# EAGLE design audibleCore (EAGLE 6.5.0)
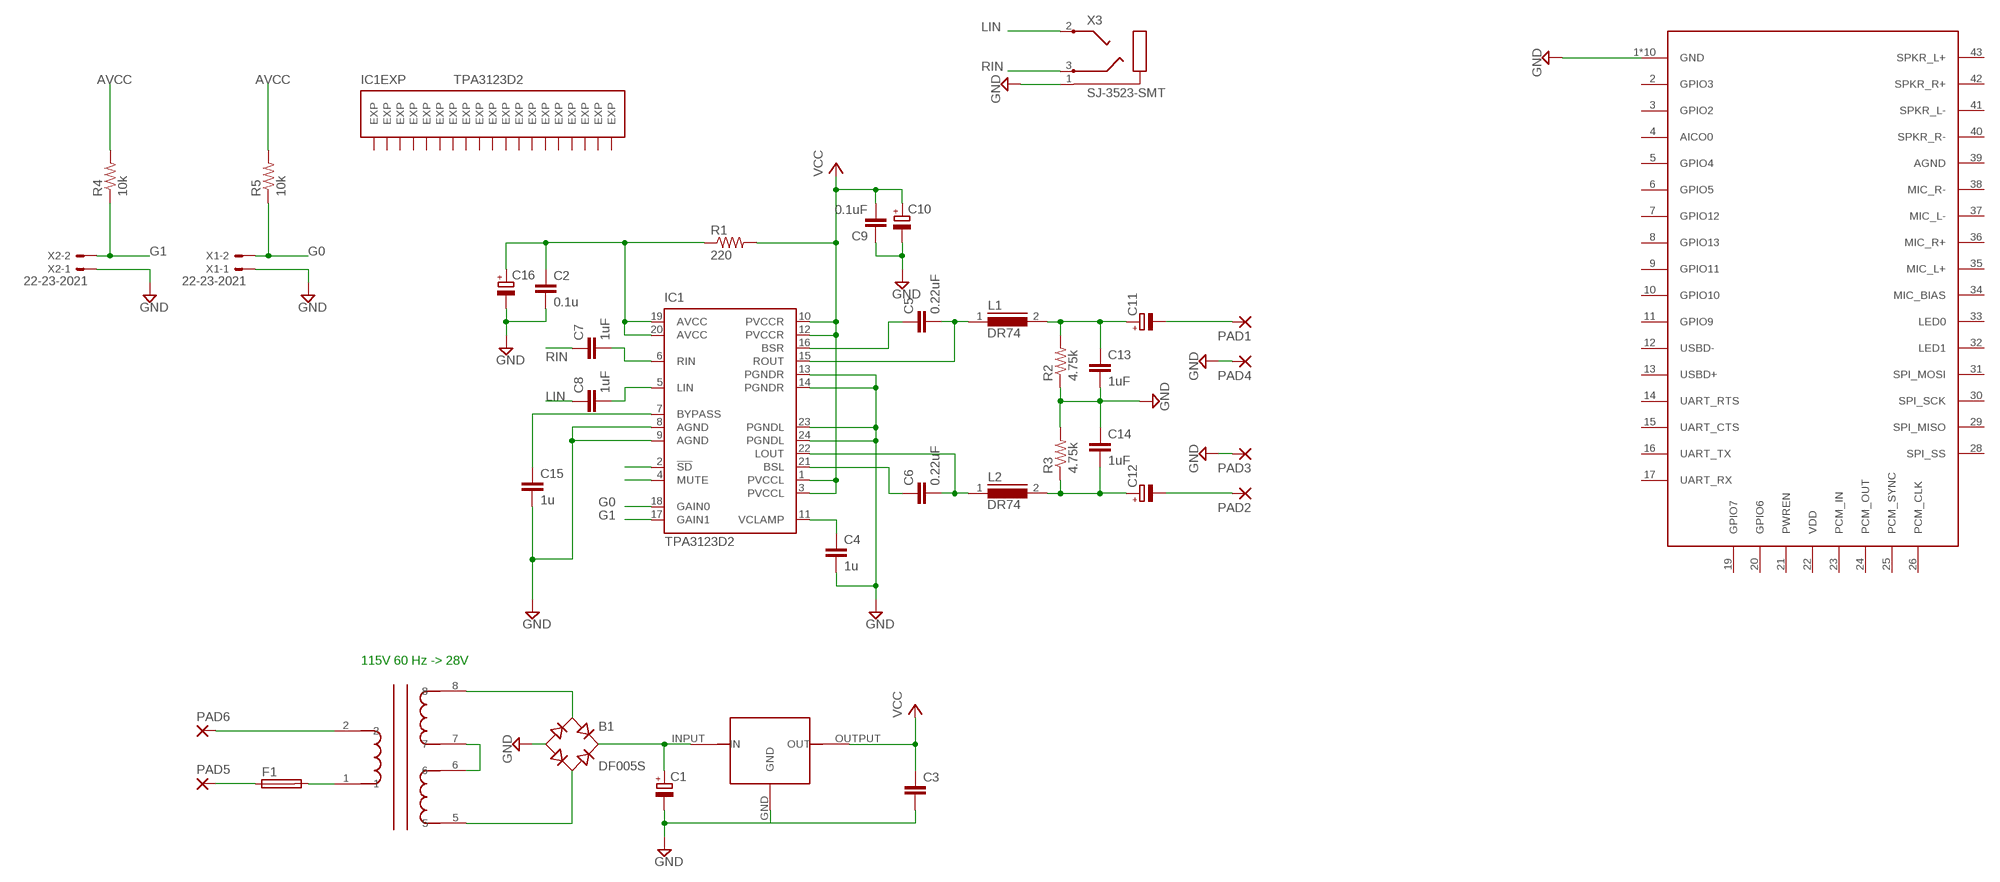
[diagram p0: schematic, sheet 1]

## Parts
B1  DF005S  [DFS]
C1  CPOL-EUG  [PANASONIC_G]
C2  0.1u  C-EUC1206  [C1206]
C3  C-EUC1206  [C1206]
C4  1u  C-EUC1206  [C1206]
C5  0.22uF  C-EUC1206  [C1206]
C6  0.22uF  C-EUC1206  [C1206]
C7  1uF  C-EUC1206  [C1206]
C8  1uF  C-EUC1206  [C1206]
C9  0.1uF  C-EUC1206  [C1206]
C10  CPOL-EUG  [PANASONIC_G]
C11  CPOL-EUG  [PANASONIC_G]
C12  CPOL-EUG  [PANASONIC_G]
C13  1uF  C-EUC1206  [C1206]
C14  1uF  C-EUC1206  [C1206]
C15  1u  C-EUC1206  [C1206]
C16  CPOL-EUG  [PANASONIC_G]
F1  GSH15  [GSH15]
IC1  TPA3123D2  [PWP-TSSOP24]
L1  DR74  [DR74]
L2  DR74  [DR74]
PAD1  SMD5  [SMD2,54-5,08]
PAD2  SMD5  [SMD2,54-5,08]
PAD3  SMD5  [SMD2,54-5,08]
PAD4  SMD5  [SMD2,54-5,08]
PAD5  SMD5  [SMD2,54-5,08]
PAD6  SMD5  [SMD2,54-5,08]
R1  220  R-US_R1206  [R1206]
R2  4.75k  R-US_R1206  [R1206]
R3  4.75k  R-US_R1206  [R1206]
R4  10k  R-US_R1206  [R1206]
R5  10k  R-US_R1206  [R1206]
U$1  ST-7-24  [ST-7]
U$2  L78XX  [D2PAK]
U$3  RN-52  [RN-52]
X1  22-23-2021  [22-23-2021]
X2  22-23-2021  [22-23-2021]
X3  SJ-3523-SMT  [SJ-3523-SMT]

## Nets
AVCC: C2.1 C16.+ IC1.19(AVCC) IC1.20(AVCC) R1.1 R4.2 R5.2
G0: IC1.18(GAIN0) R5.1 X1.2
G1: IC1.17(GAIN1) R4.1 X2.2
GND: B1.- C1.- C2.2 C3.2 C4.2 C9.1 C10.- C13.2 C14.1 C15.2 C16.- IC1.8(AGND) IC1.9(AGND) IC1.13(PGNDR) IC1.14(PGNDR) IC1.23(PGNDL) IC1.24(PGNDL) PAD3.1(P) PAD4.1(P) R2.1 R3.2 U$2.GND U$3.1(GND) U$3.18(GND) U$3.27(GND) U$3.44(GND) U$3.45(GND) U$3.46(GND) U$3.47(GND) U$3.48(GND) U$3.49(GND) U$3.50(GND) X1.1 X2.1 X3.1(EARTH)
LIN: C8.1 X3.2(TIP)
N$1: U$1.6 U$1.7
N$2: B1.AC1 U$1.8
N$3: B1.AC2 U$1.5
N$4: B1.+ C1.+ U$2.INPUT(IN)
N$5: C12.- PAD2.1(P)
N$6: C4.1 IC1.11(VCLAMP)
N$7: C5.1 IC1.16(BSR)
N$8: C6.1 IC1.21(BSL)
N$9: C6.2 IC1.22(LOUT) L2.1
N$10: C5.2 IC1.15(ROUT) L1.1
N$11: C15.1 IC1.7(BYPASS)
N$12: C7.2 IC1.6(RIN)
N$13: C8.2 IC1.5(LIN)
N$14: C11.+ C13.1 L1.2 R2.2
N$16: C12.+ C14.2 L2.2 R3.1
N$17: C11.- PAD1.1(P)
N$18: IC1.2(!SD)
N$19: IC1.4(MUTE)
N$20: PAD6.1(P) U$1.2
N$21: F1.2 U$1.1
N$22: F1.1 PAD5.1(P)
RIN: C7.1 X3.3(RING)
VCC: C3.1 C9.2 C10.+ IC1.1(PVCCL) IC1.3(PVCCL) IC1.10(PVCCR) IC1.12(PVCCR) R1.2 U$2.OUTPUT(OUT)
Unconnected: IC1.EXP IC1.EXP@1(EXP) IC1.EXP@2(EXP) IC1.EXP@3(EXP) IC1.EXP@4(EXP) IC1.EXP@5(EXP) IC1.EXP@6(EXP) IC1.EXP@7(EXP) IC1.EXP@8(EXP) IC1.EXP@9(EXP) IC1.EXP@10(EXP) IC1.EXP@11(EXP) IC1.EXP@12(EXP) IC1.EXP@13(EXP) IC1.EXP@14(EXP) IC1.EXP@15(EXP) IC1.EXP@16(EXP) IC1.EXP@17(EXP) IC1.EXP@18(EXP) U$3.2(GPIO3) U$3.3(GPIO2) U$3.4(AICO0) U$3.5(GPIO4) U$3.6(GPIO5) U$3.7(GPIO12) U$3.8(GPIO13) U$3.9(GPIO11) U$3.10(GPIO10) U$3.11(GPIO9) U$3.12(USBD-) U$3.13(USBD+) U$3.14(UART_RTS) U$3.15(UART_CTS) U$3.16(UART_TX) U$3.17(UART_RX) U$3.19(GPIO7) U$3.20(GPIO6) U$3.21(PWREN) U$3.22(VDD) U$3.23(PCM_IN) U$3.24(PCM_OUT) U$3.25(PCM_SYNC) U$3.26(PCM_CLK) U$3.28(SPI_SS) U$3.29(SPI_MISO) U$3.30(SPI_SCK) U$3.31(SPI_MOSI) U$3.32(LED1) U$3.33(LED0) U$3.34(MIC_BIAS) U$3.35(MIC_L+) U$3.36(MIC_R+) U$3.37(MIC_L-) U$3.38(MIC_R-) U$3.39(AGND) U$3.40(SPKR_R-) U$3.41(SPKR_L-) U$3.42(SPKR_R+) U$3.43(SPKR_L+)

## Notes on the sheet
- 115V 60 Hz -> 28V

## Library data of the parts
B1 = rectifier:DF*S: Surface Mount Glass Passivated Bridge Rectifiers Source: Source: Comchip Bridge Rectifiers DF005S-G thru DF10S-G.pdf
C1 C10-C12 C16 = rcl:CPOL-EU: POLARIZED CAPACITOR, European symbol
C2-C9 C13-C15 = rcl:C-EU: CAPACITOR, European symbol
F1 = fuse:GSH15: FUSE HOLDER grid 15mm, 19649 Wickmann; MPN: 64900001039; OC_FARNELL: 1271673; OC_NEWARK: 02P0318
IC1 = texas:TPA3123D2: 25-W STEREO CLASS-D AUDIO POWER AMPLIFIER Please INVOKE gate EXP, set DRC-Clearance | Same signals | SMD - SMD = 0 Source: http://focus.ti.com/lit/ds/symlink/tpa3123d2.pdf; MPN: TPA3123D2PWP; OC_FARNELL: 1632099; OC_NEWARK: 53M3994
L1 L2 = inductors:DR74: High Power Density, High Efficiency, Shielded Inductors Source: coiltronics_dr_series.pdf
PAD1-PAD6 = wirepad:SMD5: SMD PAD
R1-R5 = rcl:R-US_: RESISTOR, American symbol
U$1 = signal_transformer:ST-7-24
U$2 = st-microelectronics:L78XX
U$3 = misc:RN-52
X1 X2 = con-molex:22-23-2021: .100" (2.54mm) Center Header - 2 Pin; MF: MOLEX; MPN: 22-23-2021; OC_FARNELL: 1462926; OC_NEWARK: 25C3832
X3 = con-cuistack:SJ-3523: 3.5 Stereo audio jack (SMT)

## Board
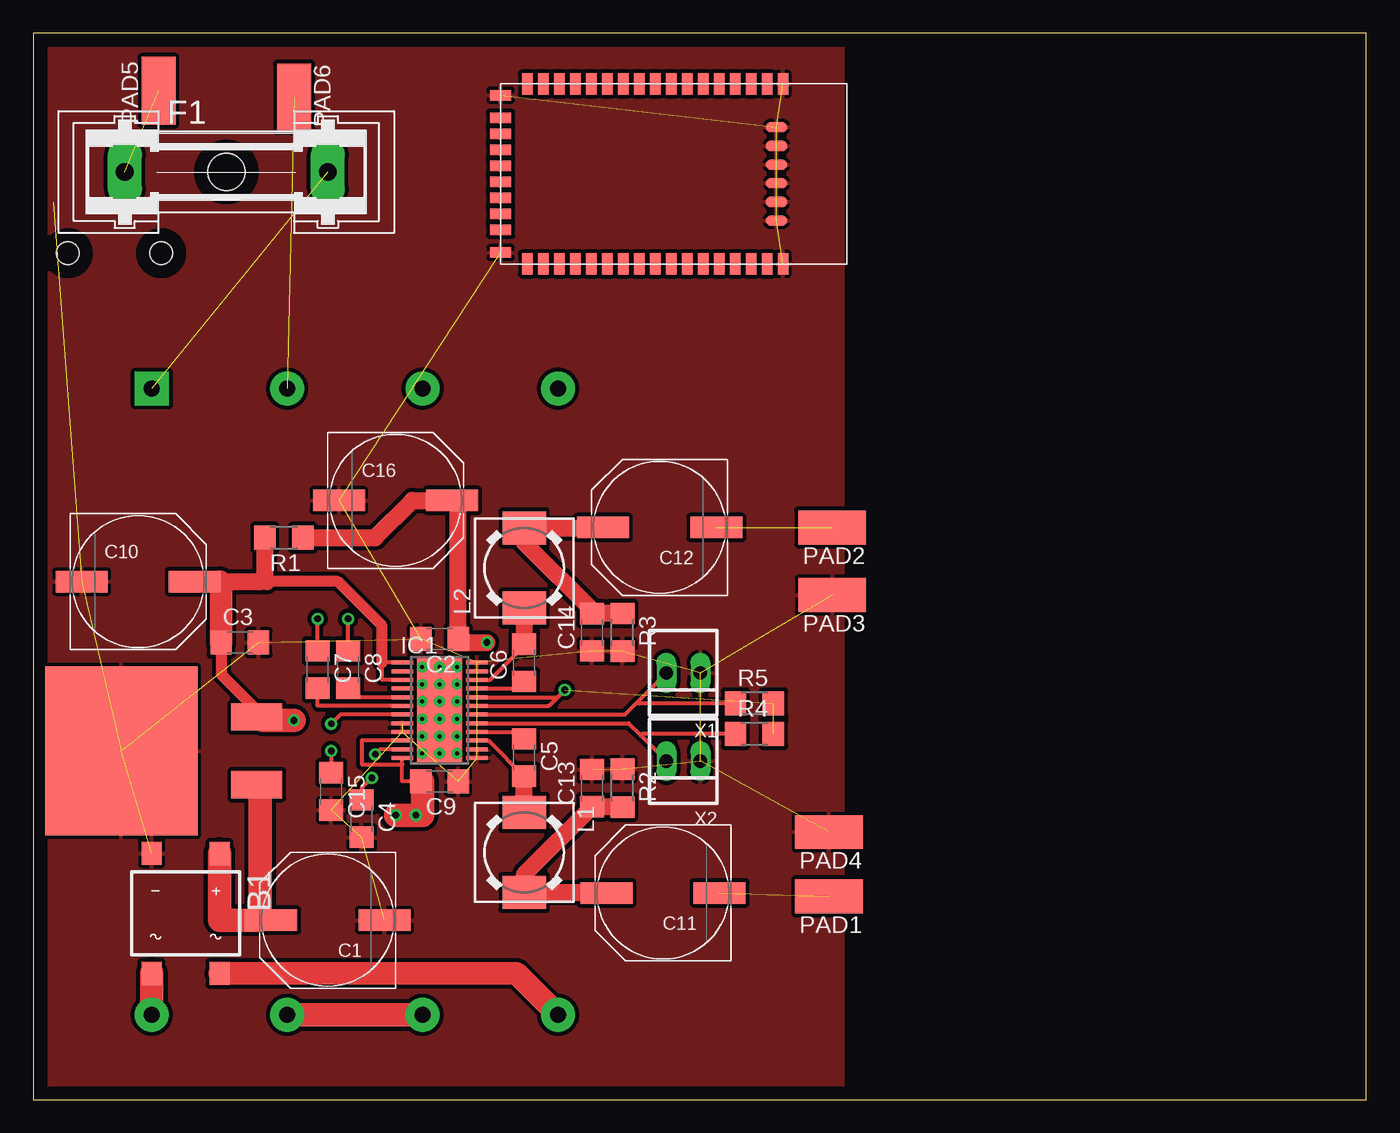
[diagram p1: board, top side]
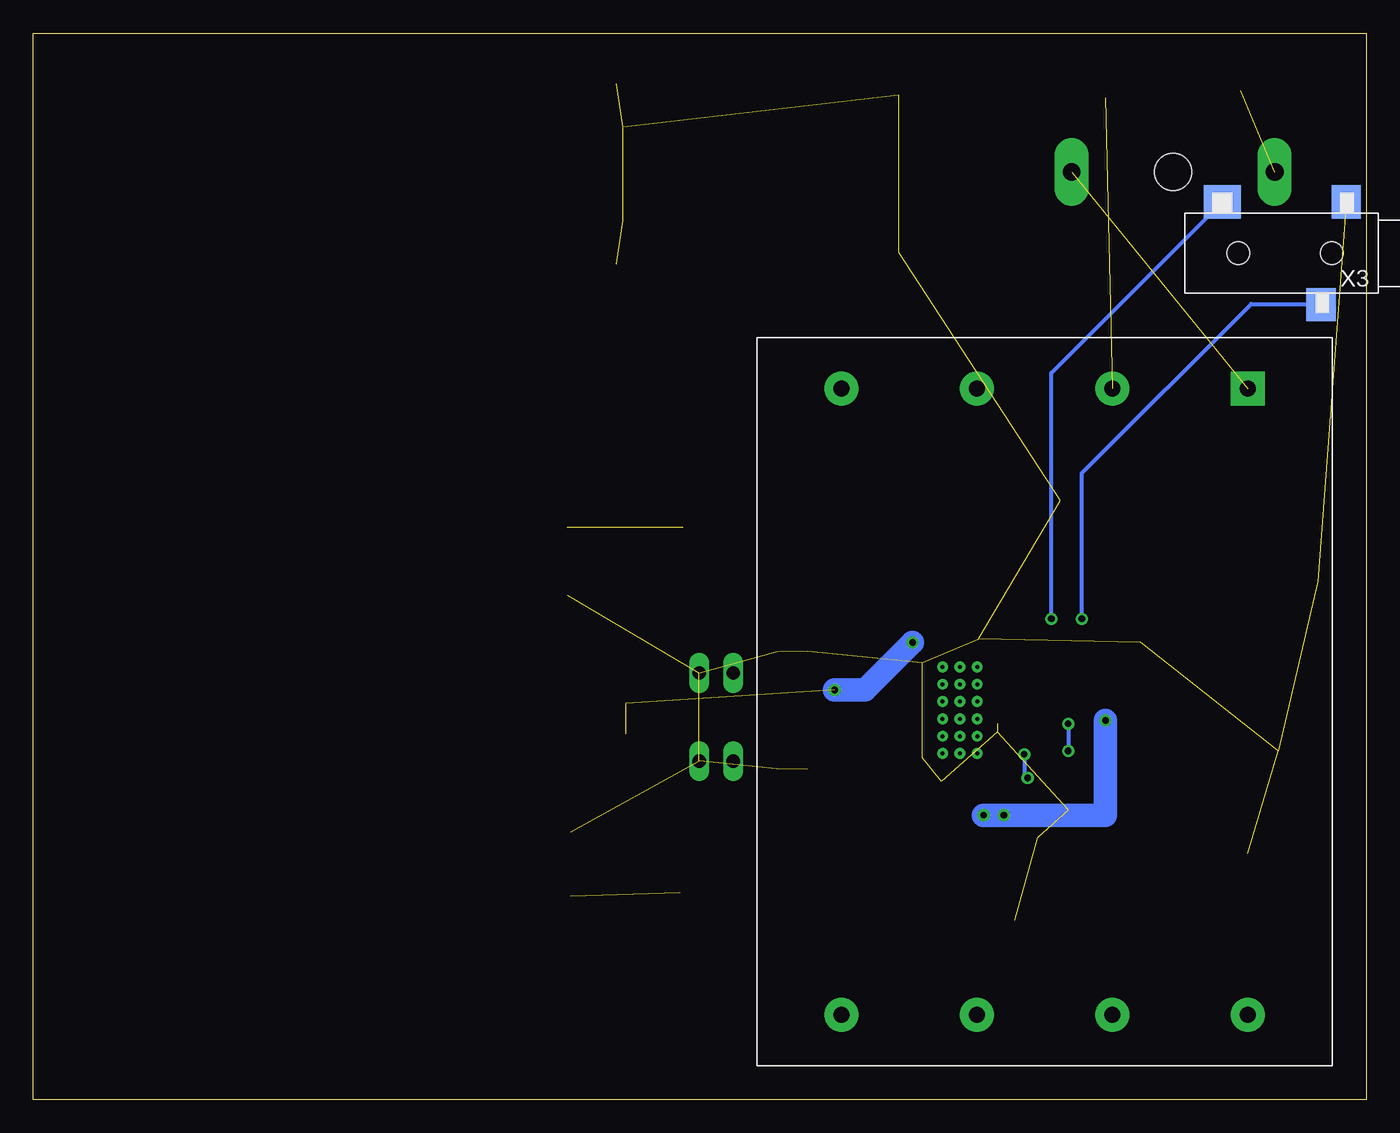
[diagram p2: board, bottom side, seen from below]

Size 100 x 80 mm. Coordinates in mm from the lower left corner, seen from the top.
Outline: 0,0 100,0 100,80 0,80 0,0
Copper layers (1*16): Top 0.035mm / dielectric 1.5mm / Bottom 0.035mm
Design rules "default": minimum track width 10mil, minimum drill 24mil, track to track 8mil, track to pad 8mil, pad to pad 8mil, via to via 8mil, smd to smd 8mil, copper to edge 40mil, drill to drill 8mil, minimum pad ring 10mil, minimum via ring 8mil, stop-mask expansion 4mil, vias tented up to drill 0mil, thermal gap 10mil

### Footprints (pad centres in the part's own frame; a part is rotated, then mirrored left to right if it is on the bottom)
DFS = smd 1.5 x 1.7: + -2.55,-4.5; - 2.55,-4.5; AC1 -2.55,4.5; AC2 2.55,4.5
PANASONIC_G = smd 3.9 x 1.6: + 4.25,0; - -4.25,0
C1206 = smd 1.6 x 1.8: 1 -1.4,0; 2 1.4,0
GSH15 = drill 1.321 pad 2.54 long: 1 -7.62,0; 2 7.62,0 | hole 2.794: 0,0
PWP-TSSOP24 = smd 1.6 x 0.3: 1 -2.8,3.575; 2 -2.8,2.925; 3 -2.8,2.275; 4 -2.8,1.625; 5 -2.8,0.975; 6 -2.8,0.325; 7 -2.8,-0.325; 8 -2.8,-0.975; 9 -2.8,-1.625; 10 -2.8,-2.275; 11 -2.8,-2.925; 12 -2.8,-3.575; 13 2.8,-3.575; 14 2.8,-2.925; 15 2.8,-2.275; 16 2.8,-1.625; 17 2.8,-0.975; 18 2.8,-0.325; 19 2.8,0.325; 20 2.8,0.975; 21 2.8,1.625; 22 2.8,2.275; 23 2.8,2.925; 24 2.8,3.575 | smd 3.4 x 7.8: EXP 0,0 | drill 0.3 pad 0.7: EXP@1 -1.3,3.25; EXP@2 0,3.25; EXP@3 1.3,3.25; EXP@4 -1.3,1.95; EXP@5 0,1.95; EXP@6 1.3,1.95; EXP@7 -1.3,0.65; EXP@8 0,0.65; EXP@9 1.3,0.65; EXP@10 -1.3,-0.65; EXP@11 0,-0.65; EXP@12 1.3,-0.65; EXP@13 -1.3,-1.95; EXP@14 0,-1.95; EXP@15 1.3,-1.95; EXP@16 -1.3,-3.25; EXP@17 0,-3.25; EXP@18 1.3,-3.25
DR74 = smd 2.5 x 3.25: 1 -3,0; 2 3,0
SMD2,54-5,08 = smd 2.54 x 5.08: 1 0,0
R1206 = smd 1.6 x 1.803: 1 -1.422,0; 2 1.422,0
ST-7 = drill 1.2 pad 2.54 square: 1 0,0 | drill 1.2 pad 2.54: 2 0,-10.16; 3 0,-20.32; 4 0,-30.48; 5 46.99,0; 6 46.99,-10.16; 7 46.99,-20.32; 8 46.99,-30.48
D2PAK = smd 12.7 x 11.43: GND 0,10.16 | smd 2.032 x 3.81: INPUT -2.54,0; OUTPUT 2.54,0
RN-52 = smd 1.6 x 0.8: 1 0,21.2; 2 0,20; 3 0,18.8; 4 0,17.6; 5 0,16.4; 6 0,15.2; 7 0,14; 8 0,12.8; 9 0,11.6; 10 0,10.4; 11 0,9.2; 12 0,8; 13 0,6.8; 14 0,5.6; 15 0,4.4; 16 0,3.2; 17 0,2; 28 13.5,2; 29 13.5,3.2; 30 13.5,4.4; 31 13.5,5.6; 32 13.5,6.8; 33 13.5,8; 34 13.5,9.2; 35 13.5,10.4; 36 13.5,11.6; 37 13.5,12.8; 38 13.5,14; 39 13.5,15.2; 40 13.5,16.4; 41 13.5,17.6; 42 13.5,18.8; 43 13.5,20; 44 13.5,21.2 | smd 0.8 x 1.6: 18 0.85,0; 19 2.55,0; 20 3.75,0; 21 4.95,0; 22 6.15,0; 23 7.35,0; 24 8.55,0; 25 9.75,0; 26 10.95,0; 27 12.65,0; 45 10.25,20.7; 46 8.85,20.7; 47 7.45,20.7; 48 6.05,20.7; 49 4.65,20.7; 50 3.25,20.7
22-23-2021 = drill 1 long: 1 -1.27,0; 2 1.27,0
SJ-3523-SMT = smd 2.5 x 2.2: 1 3.85,-4.6; 3 -3.85,-2.7 | smd 2.5 x 2.8: 2 3.85,4.7 | hole 1.7: 0,-3.5; 0,3.5

### Placement (x,y rotation side)
B1  11.43,13.97 180 top
C1  22.1,13.46 180 top
C2  30.48,34.54 180 top
C3  15.49,34.29 0 top
C4  24.64,21.08 270 top
C5  36.83,25.65 270 top
C6  36.83,32.77 90 top
C7  21.34,32.26 270 top
C8  23.62,32.26 270 top
C9  30.48,23.88 180 top
C10  7.87,38.86 0 top
C11  47.24,15.49 180 top
C12  46.99,42.93 180 top
C13  41.91,23.37 90 top
C14  41.91,35.05 90 top
C15  22.35,23.11 270 top
C16  27.18,44.96 0 top
F1  14.48,69.6 0 top
IC1  30.48,29.21 0 top
L1  36.83,18.54 270 top
L2  36.83,39.88 90 top
PAD1  59.69,15.24 90 top
PAD2  59.94,42.93 90 top
PAD3  59.94,37.85 90 top
PAD4  59.69,20.07 90 top
PAD5  9.4,75.69 0 top
PAD6  19.56,75.18 180 top
R1  18.8,42.16 180 top
R2  44.2,23.37 270 top
R3  44.2,35.05 270 top
R4  54.1,27.43 0 top
R5  54.1,29.72 0 top
U$1  8.89,53.34 270 bottom
U$2  16.76,26.16 90 top
U$3  35.05,76.2 270 top
X1  48.77,32 180 top
X2  48.77,25.4 180 top
X3  6.1,63.5 90 bottom

### Tracks (layer width: path | path; a pad name or v marks a point on that pad's centre or on a via)
AVCC  (via drill 0.5)  (2 unrouted)
  Top 0.305: 31.88,44.51 C16.+ | IC1.19 38.68,29.54 39.33,30.18 | IC1.20 39.33,30.18 | C2.1 32.13,34.29 | v39.88,30.73 39.33,30.18
  Top 1.27: C16.+ 28.45,44.96 25.65,42.16 R1.1 | C2.1 31.88,44.51 | 32.13,34.29 v34.04,34.29
  Bottom 1.778: v34.04,34.29 37.59,30.73 v39.88,30.73
G0
  Top 0.305: IC1.18 44.38,28.89 45.34,29.84 | 45.34,29.84 X1.2 | R5.1 45.47,29.72 45.34,29.84
G1
  Top 0.305: IC1.17 44.66,28.23 45.59,27.3 | 45.59,27.3 X2.2 | R4.1 45.72,27.43 45.59,27.3
GND  (34 unrouted)
  Top 0.305: 41.91,24.79 C13.2
  pour Top (isolate 0.305): 1.02,78.99 60.71,78.99 60.71,0.51 1.02,0.51
LIN  (via drill 0.5)
  Top 0.305: C8.1 v23.62,36.07
  Bottom 0.305: v23.62,36.07 23.62,54.52 X3.2
N$1
  Top 1.778: U$1.6 U$1.7
N$2
  Top 1.676: B1.AC1 36.25,9.47 U$1.8
N$3
  Top 0.305: B1.AC2
  Top 1.778: B1.AC2 U$1.5
N$4
  Top 0.305: C1.+ 17.02,13.46 | U$2.INPUT 17.02,23.62
  Top 1.778: B1.+ 13.98,13.46 17.02,13.46 17.02,23.62
N$5  (1 unrouted)
N$6  (via drill 0.5)
  Top 0.305: IC1.11 26.03,26.29 v25.65,25.91 | v25.4,24.13 24.64,23.37 C4.1
  Bottom 0.305: v25.65,25.91 25.65,24.38 v25.4,24.13
N$7
  Top 0.305: IC1.16 36.83,27.59 C5.1
N$8
  Top 0.305: IC1.21 36.83,30.84 C6.1
N$9
  Top 0.305: IC1.22 34.28,31.48 36.83,34.04 C6.2
  Top 1.27: L2.1 C6.2
N$10
  Top 0.305: IC1.15 34.15,26.93 C5.2
  Top 1.27: L1.1 C5.2
N$11  (via drill 0.5)
  Top 0.305: IC1.7 23.04,28.89 v22.35,28.19 | v22.35,26.16 C15.1
  Bottom 0.305: v22.35,28.19 v22.35,26.16
N$12
  Top 0.305: IC1.6 21.34,29.54 C7.2
N$13
  Top 0.305: IC1.5 23.62,30.18 C8.2
N$14
  Top 0.305: 41.91,21.95 C13.1 | C11.+ 41.91,15.49
  Top 1.27: R2.2 41.91,21.95 | 41.91,15.49 41.86,15.54 L1.2 36.83,16.89 C13.1
N$16
  Top 0.305: 42.16,42.88 42.74,42.88 C12.+ | 42.16,36.45 C14.2 41.91,36.47
  Top 1.27: 42.16,42.88 L2.2 36.83,41.79 42.16,36.45 | R3.1 41.91,36.47
N$17  (1 unrouted)
N$20  (1 unrouted)
N$21  (1 unrouted)
N$22  (1 unrouted)
RIN  (via drill 0.5)
  Top 0.305: C7.1 v21.34,36.07
  Bottom 0.305: v21.34,36.07 21.34,46.99 8.64,59.69 3.44,59.69 X3.3
VCC  (via drill 0.5)
  Top 0.305: 27.68,25.15 27.68,23.88 C9.2 29.21,23.88 | 27.68,25.15 IC1.12 | IC1.10 24.64,26.93 24.64,25.15 27.68,25.15 | IC1.1 26.16,32.78 26.16,31.48 IC1.3 | U$2.OUTPUT 17.27,28.7 | 17.27,28.7 18.29,28.7 | 17.27,28.45 17.27,28.7 | 17.37,39.01 17.53,38.86 | 17.37,39.22 17.02,38.86
  Top 0.61: 13.97,34.17 C3.1
  Top 0.813: 26.16,32.78 26.16,35.56 22.86,38.86 17.53,38.86 | C3.1 14.09,31.88 17.27,28.7
  Top 1.27: 17.53,38.86 17.02,38.86 13.97,38.86 C10.+ | R1.2 17.37,39.22
  Top 1.676: C3.1 14.09,38.74 13.97,38.86
  Top 1.778: v19.56,28.45 17.27,28.45 | 29.21,23.88 29.21,21.34 v27.18,21.34
  Bottom 1.778: v19.56,28.45 19.56,21.34 v27.18,21.34 v28.7,21.34